# Altium schematic sheet Sheet1.SchDoc
size A
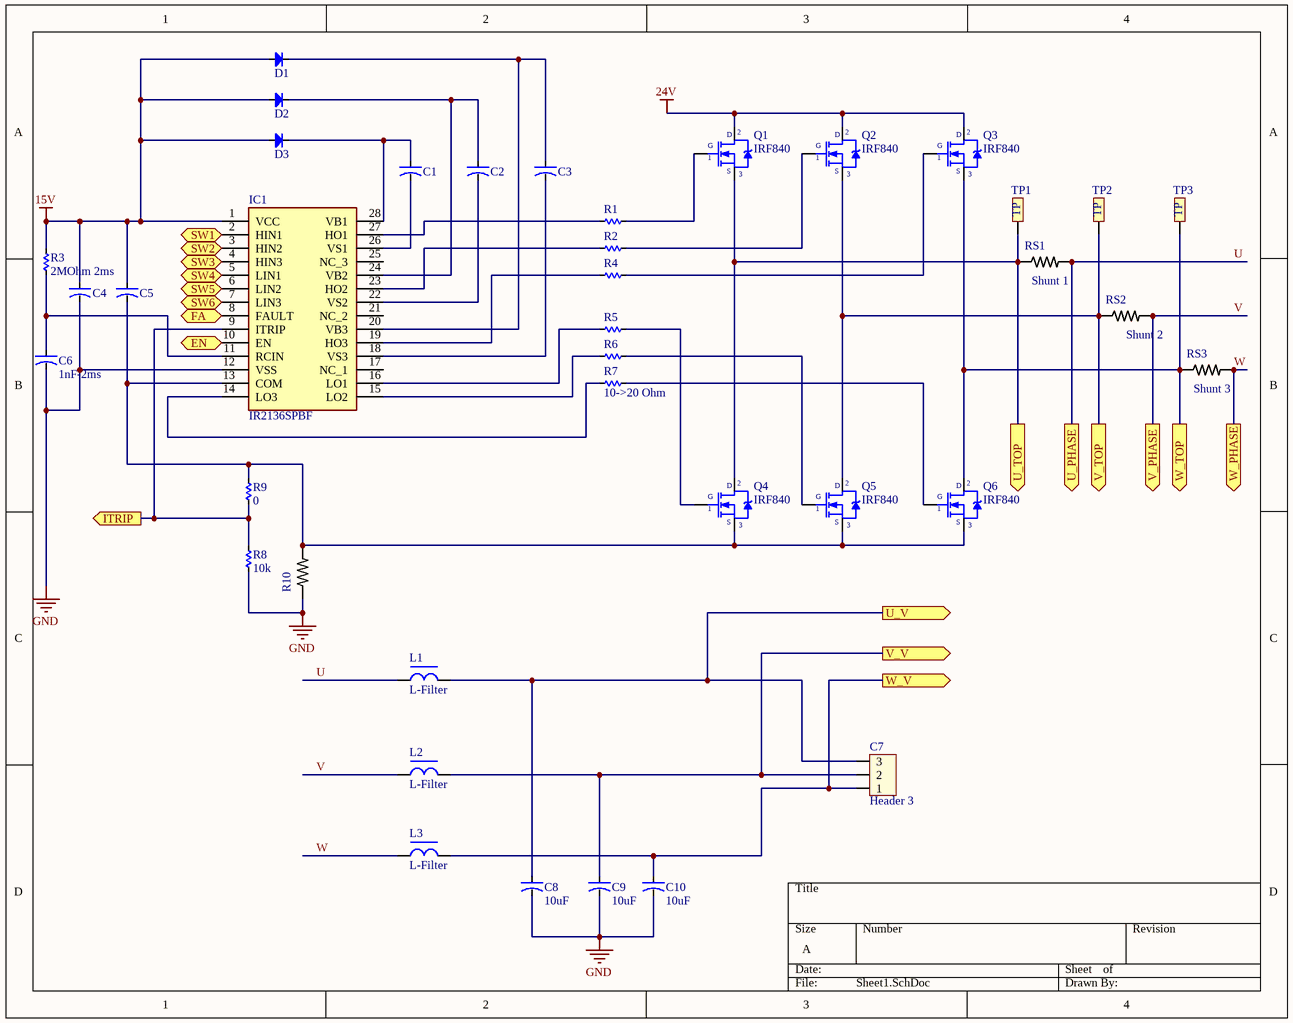
[diagram p0: Sheet1.SchDoc]

## Parts
C1  50-100uF  [CA-ALU-5R]  (value not drawn)
C2  50-100uF  [CA-ALU-5R]  (value not drawn)
C3  50-100uF  [CA-ALU-5R]  (value not drawn)
C4  to  [CA-ALU-5R]  (value not drawn)
C5  to  [CA-ALU-5R]  (value not drawn)
C6  1nF-2ms  [CA-ALU-2.54]
C7  Header 3  [HED3]
C8  10uF  [CA-ALU-5R]
C9  10uF  [CA-ALU-5R]
C10  10uF  [CA-ALU-5R]
D1  Diode  [DIO-1A]  (value not drawn)
D2  Diode  [DIO-1A]  (value not drawn)
D3  Diode  [DIO-1A]  (value not drawn)
IC1  IR2136SPBF  [SOIC127P1032X265-28N]
L1  L-Filter  [L-DIP-M-5.3]
L2  L-Filter  [L-DIP-M-5.3]
L3  L-Filter  [L-DIP-M-5.3]
Q1  IRF840  [TO220-123]
Q2  IRF840  [TO220-123]
Q3  IRF840  [TO220-123]
Q4  IRF840  [TO220-123]
Q5  IRF840  [TO220-123]
Q6  IRF840  [TO220-123]
R1  10->20 Ohm  [RES-1/2W]  (value not drawn)
R2  1K10->20 Ohm  [RES-1/2W]  (value not drawn)
R3  2MOhm 2ms  [RES-1/2W]
R4  10->20 Ohm  [RES-1/2W]  (value not drawn)
R5  10->20 Ohm  [RES-1/2W]  (value not drawn)
R6  10->20 Ohm  [RES-1/2W]  (value not drawn)
R7  10->20 Ohm  [RES-1/2W]
R8  10k  [RES-1/2W]
R9  0  [RES-1/2W]
R10  1-1625873-0  [*RESAD640W45L370D200]  (value not drawn)
RS1  1-1625873-0  [*RESAD640W45L370D200]  (value not drawn)
RS2  1-1625873-0  [*RESAD640W45L370D200]  (value not drawn)
RS3  1-1625873-0  [*RESAD640W45L370D200]  (value not drawn)
TP1  (no value)  [TP]
TP2  (no value)  [TP]
TP3  (no value)  [TP]

## Ports
EN (in), FA (out), ITRIP (out), SW1 (in), SW2 (in), SW3 (in), SW4 (in), SW5 (in), SW6 (in), U_PHASE (out), U_TOP (out), U_V (out), V_PHASE (out), V_TOP (out), V_V (out), W_PHASE (out), W_TOP (out), W_V (out)

## Nets
15V: C4.1 C5.1 D1.1(A) D2.1(A) D3.1(A) IC1.1(VCC) R3.1
24V: Q1.2(D) Q2.2(D) Q3.2(D)
GND: C4.2 C6.2 C8.2 C9.2 C10.2 IC1.12(VSS) R8.2 R10.1
EN: IC1.10(EN) ; port EN
FA: IC1.8(FAULT) ; port FA
ITRIP: IC1.9(ITRIP) R8.1 R9.2 ; port ITRIP
SW1: IC1.2(HIN1) ; port SW1
SW2: IC1.3(HIN2) ; port SW2
SW3: IC1.4(HIN3) ; port SW3
SW4: IC1.5(LIN1) ; port SW4
SW5: IC1.6(LIN2) ; port SW5
SW6: IC1.7(LIN3) ; port SW6
U: L1.1 RS1.2 ; port U_PHASE
U_TOP: Q1.3(S) Q4.2(D) RS1.1 TP1.TP1 ; port U_TOP
U_V: C7.3 C8.1 L1.2 ; port U_V
V: L2.1 RS2.2 ; port V_PHASE
V_TOP: Q2.3(S) Q5.2(D) RS2.1 TP2.TP1 ; port V_TOP
V_V: C7.2 C9.1 L2.2 ; port V_V
W: L3.1 RS3.2 ; port W_PHASE
W_TOP: Q3.3(S) Q6.2(D) RS3.1 TP3.TP1 ; port W_TOP
W_V: C7.1 C10.1 L3.2 ; port W_V
NetC1_1: C1.1 D3.2(K) IC1.28(VB1)
NetC1_2: C1.2 IC1.26(VS1)
NetC2_1: C2.1 D2.2(K) IC1.24(VB2)
NetC2_2: C2.2 IC1.22(VS2)
NetC3_1: C3.1 D1.2(K) IC1.20(VB3)
NetC3_2: C3.2 IC1.18(VS3)
NetC5_2: C5.2 IC1.13(COM) Q4.3(S) Q5.3(S) Q6.3(S) R9.1 R10.2
NetC6_1: C6.1 IC1.11(RCIN) R3.2
NetIC1_14: IC1.14(LO3) R7.2
NetIC1_15: IC1.15(LO2) R6.2
NetIC1_16: IC1.16(LO1) R5.2
NetIC1_19: IC1.19(HO3) R4.2
NetIC1_23: IC1.23(HO2) R2.2
NetIC1_27: IC1.27(HO1) R1.2
NetQ1_1: Q1.1(G) R1.1
NetQ2_1: Q2.1(G) R2.1
NetQ3_1: Q3.1(G) R4.1
NetQ4_1: Q4.1(G) R5.1
NetQ5_1: Q5.1(G) R6.1
NetQ6_1: Q6.1(G) R7.1

Not connected (* = marked no-connect by the designer): IC1 17(NC_1) 21(NC_2) 25(NC_3)

## Notes on the sheet
- (near RS1) Shunt 1
- (near RS2) Shunt 2
- (near RS3) Shunt 3

## Library data of the parts
C1-C6 C8-C10 = CN-ALU-DIP: Capacitor (Semiconductor SIM Model); Value: 104; LatestRevisionDate: 17-Jul-2002; LatestRevisionNote: Re-released for DXP Platform.; PackageReference: C1206; Publisher: Altium Limited
C7 = Hed3: Header 3 (Green); Value: Header 3
D1-D3 = Diode: Default Diode; Code - JEDEC: DO-214-AB; Value: 1N5007; Published: 8-Jun-2000; Revision: July-2002: Re-released for DXP Platform.; Publisher: Altium Limited
IC1 = IR2136SPBF: Integrated Circuit; Manufacturer_Name: Infineon; Allied_Number: 70017147; Datasheet Link: https://www.infineon.com/dgdl/ir2136.pdf?fileId=5546d462533600a4015355c8a02116a5; Height: 2.65mm; Manufacturer_Part_Number: IR2136SPBF; Mouser Part Number: 942-IR2136SPBF; Mouser Price/Stock: https://www.mouser.co.uk/ProductDetail/Infineon-IR/IR2136SPBF?qs=ellYJlE8XiFRzygBXfcgZw%3D%3D; RS Part Number: 5412284P; RS Price/Stock: http://uk.rs-online.com/web/p/products/5412284P; Allied Price/Stock: https://www.alliedelec.com/infineon-ir2136spbf/70017147/
L1-L3 = L-DIP-1: Inductor; Value: 150 mH
Q1-Q6 = IRF840: MOSFET N - CHANNEL 500V - 0.75 - 8A - TO-220; Value: IRF840
R1-R9 = Res: Manufacturer: Generic Components; Class: Passive; SubClass: R; Published: 08/06/2000; Publisher: Altium Hobart Technology Centre
R10 RS1-RS3 = RES_KIT_LR0204R: RS LR0204 RESISTOR KIT; MF: TE Connectivity AMP Connectors; MP: RES KIT LR0204R; Availability: Unavailable; SnapEDA_Link: https://www.snapeda.com/parts/RES%20KIT%20LR0204R/TE%20Connectivity/view-part/3223324/?ref=snap; Price: None; TE_purchase_URL: https://www.te.com/usa-en/product-1-1625873-0.html?te_bu=Cor&te_type=disp&te_campaign=seda_glo_cor-seda-global-disp-prtnr-fy19-seda-model-bom-cta_sma-317_1&elqCampaignId=32493; Package: None; Value: *
TP1-TP3 = TP: CONNECT 1